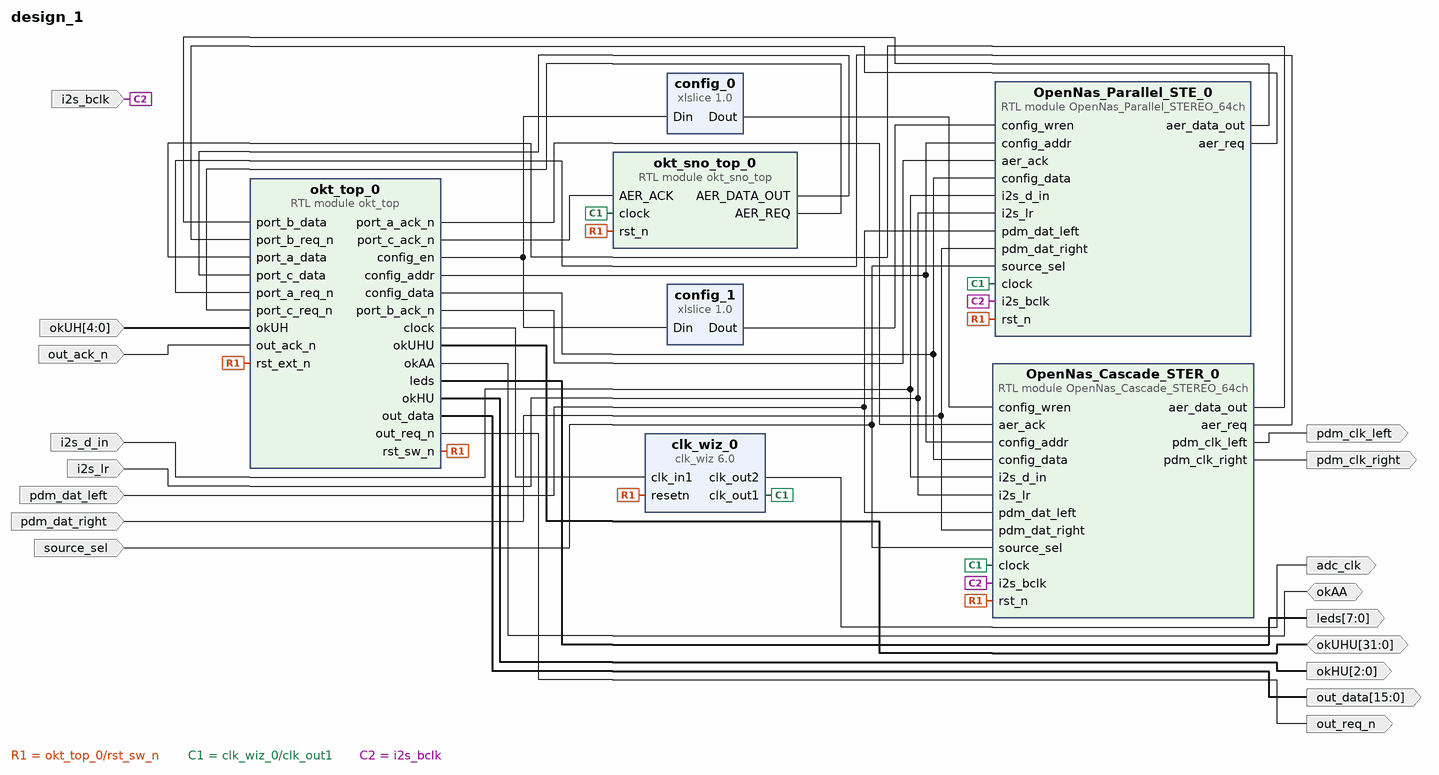
[diagram p0: block diagram of the top level]
# Vivado block design design_1, xc7a200tfbg484-1, Vivado 2022.1
create_bd_design design_1

create_bd_port -dir I pdm_dat_left
create_bd_port -dir I pdm_dat_right
create_bd_port -dir I i2s_bclk
create_bd_port -dir I i2s_d_in
create_bd_port -dir I i2s_lr
create_bd_port -dir I source_sel
create_bd_port -dir O pdm_clk_left
create_bd_port -dir O pdm_clk_right
create_bd_port -dir O -from 7 -to 0 leds
create_bd_port -dir O -from 15 -to 0 out_data
create_bd_port -dir O out_req_n
create_bd_port -dir I out_ack_n
create_bd_port -dir I -from 4 -to 0 okUH
create_bd_port -dir O -from 2 -to 0 okHU
create_bd_port -dir IO -from 31 -to 0 okUHU
create_bd_port -dir IO okAA
create_bd_port -dir O -type clk adc_clk

create_bd_cell -type ip -vlnv xilinx.com:ip:clk_wiz:6.0 clk_wiz_0
set_property -dict [list \
  CONFIG.CLKIN1_JITTER_PS 99.2 \
  CONFIG.CLKIN2_JITTER_PS 166.66 \
  CONFIG.CLKOUT1_DRIVES BUFG \
  CONFIG.CLKOUT1_JITTER 440.980 \
  CONFIG.CLKOUT1_PHASE_ERROR 472.788 \
  CONFIG.CLKOUT1_REQUESTED_DUTY_CYCLE 50.000 \
  CONFIG.CLKOUT1_REQUESTED_OUT_FREQ 48 \
  CONFIG.CLKOUT2_DRIVES BUFG \
  CONFIG.CLKOUT2_JITTER 439.220 \
  CONFIG.CLKOUT2_PHASE_ERROR 472.788 \
  CONFIG.CLKOUT2_REQUESTED_OUT_FREQ 49.152 \
  CONFIG.CLKOUT2_USED true \
  CONFIG.CLKOUT3_DRIVES BUFG \
  CONFIG.CLKOUT4_DRIVES BUFG \
  CONFIG.CLKOUT5_DRIVES BUFG \
  CONFIG.CLKOUT6_DRIVES BUFG \
  CONFIG.CLKOUT7_DRIVES BUFG \
  CONFIG.ENABLE_CLOCK_MONITOR false \
  CONFIG.FEEDBACK_SOURCE FDBK_AUTO \
  CONFIG.JITTER_SEL No_Jitter \
  CONFIG.MMCM_BANDWIDTH OPTIMIZED \
  CONFIG.MMCM_CLKFBOUT_MULT_F 51.250 \
  CONFIG.MMCM_CLKIN1_PERIOD 9.921 \
  CONFIG.MMCM_CLKIN2_PERIOD 10.000 \
  CONFIG.MMCM_CLKOUT0_DIVIDE_F 15.375 \
  CONFIG.MMCM_CLKOUT1_DIVIDE 15 \
  CONFIG.MMCM_COMPENSATION ZHOLD \
  CONFIG.MMCM_DIVCLK_DIVIDE 7 \
  CONFIG.NUM_OUT_CLKS 2 \
  CONFIG.OVERRIDE_MMCM false \
  CONFIG.PRIMITIVE MMCM \
  CONFIG.PRIM_IN_FREQ 100.800 \
  CONFIG.RESET_PORT resetn \
  CONFIG.RESET_TYPE ACTIVE_LOW \
  CONFIG.SECONDARY_IN_FREQ 100.000 \
  CONFIG.SECONDARY_SOURCE Single_ended_clock_capable_pin \
  CONFIG.USE_INCLK_SWITCHOVER false \
  CONFIG.USE_LOCKED true \
  CONFIG.USE_PHASE_ALIGNMENT true \
] [get_bd_cells clk_wiz_0]
create_bd_cell -type ip -vlnv xilinx.com:ip:xlslice:1.0 config_0
set_property -dict {CONFIG.DIN_FROM 0 CONFIG.DIN_TO 0 CONFIG.DIN_WIDTH 3 CONFIG.DOUT_WIDTH 1} [get_bd_cells config_0]
create_bd_cell -type ip -vlnv xilinx.com:ip:xlslice:1.0 config_1
set_property -dict {CONFIG.DIN_FROM 1 CONFIG.DIN_TO 1 CONFIG.DIN_WIDTH 3 CONFIG.DOUT_WIDTH 1} [get_bd_cells config_1]
create_bd_cell -type module -reference OpenNas_Cascade_STEREO_64ch OpenNas_Cascade_STER_0
create_bd_cell -type module -reference OpenNas_Parallel_STEREO_64ch OpenNas_Parallel_STE_0
create_bd_cell -type module -reference okt_sno_top okt_sno_top_0
create_bd_cell -type module -reference okt_top okt_top_0

# ---- connections ----

connect_bd_net -net Net [get_bd_pins okt_top_0/rst_sw_n] \
  [get_bd_pins clk_wiz_0/resetn] [get_bd_pins OpenNas_Cascade_STER_0/rst_n] [get_bd_pins OpenNas_Parallel_STE_0/rst_n] \
  [get_bd_pins okt_sno_top_0/rst_n] [get_bd_pins okt_top_0/rst_ext_n]
connect_bd_net [get_bd_ports okUHU] [get_bd_pins okt_top_0/okUHU]
connect_bd_net [get_bd_ports okAA] [get_bd_pins okt_top_0/okAA]
connect_bd_net -net OpenNas_Cascade_STER_0_aer_data_out [get_bd_pins OpenNas_Cascade_STER_0/aer_data_out] [get_bd_pins okt_top_0/port_a_data]
connect_bd_net -net OpenNas_Cascade_STER_0_aer_req [get_bd_pins OpenNas_Cascade_STER_0/aer_req] [get_bd_pins okt_top_0/port_a_req_n]
connect_bd_net -net OpenNas_Cascade_STER_0_pdm_clk_left [get_bd_pins OpenNas_Cascade_STER_0/pdm_clk_left] [get_bd_ports pdm_clk_left]
connect_bd_net -net OpenNas_Cascade_STER_0_pdm_clk_right [get_bd_pins OpenNas_Cascade_STER_0/pdm_clk_right] [get_bd_ports pdm_clk_right]
connect_bd_net -net OpenNas_Parallel_STE_0_aer_data_out [get_bd_pins OpenNas_Parallel_STE_0/aer_data_out] [get_bd_pins okt_top_0/port_b_data]
connect_bd_net -net OpenNas_Parallel_STE_0_aer_req [get_bd_pins OpenNas_Parallel_STE_0/aer_req] [get_bd_pins okt_top_0/port_b_req_n]
connect_bd_net [get_bd_pins clk_wiz_0/clk_out1] \
  [get_bd_pins OpenNas_Cascade_STER_0/clock] [get_bd_pins OpenNas_Parallel_STE_0/clock] [get_bd_pins okt_sno_top_0/clock]
connect_bd_net [get_bd_pins clk_wiz_0/clk_out2] [get_bd_ports adc_clk]
connect_bd_net -net config_1_Dout [get_bd_pins config_1/Dout] [get_bd_pins OpenNas_Parallel_STE_0/config_wren]
connect_bd_net -net i2s_bclk_0_1 [get_bd_ports i2s_bclk] [get_bd_pins OpenNas_Cascade_STER_0/i2s_bclk] [get_bd_pins OpenNas_Parallel_STE_0/i2s_bclk]
connect_bd_net -net i2s_d_in_0_1 [get_bd_ports i2s_d_in] [get_bd_pins OpenNas_Cascade_STER_0/i2s_d_in] [get_bd_pins OpenNas_Parallel_STE_0/i2s_d_in]
connect_bd_net -net i2s_lr_0_1 [get_bd_ports i2s_lr] [get_bd_pins OpenNas_Cascade_STER_0/i2s_lr] [get_bd_pins OpenNas_Parallel_STE_0/i2s_lr]
connect_bd_net -net okUH_0_1 [get_bd_ports okUH] [get_bd_pins okt_top_0/okUH]
connect_bd_net -net okt_sno_top_0_AER_DATA_OUT [get_bd_pins okt_sno_top_0/AER_DATA_OUT] [get_bd_pins okt_top_0/port_c_data]
connect_bd_net -net okt_sno_top_0_AER_REQ [get_bd_pins okt_sno_top_0/AER_REQ] [get_bd_pins okt_top_0/port_c_req_n]
connect_bd_net [get_bd_pins okt_top_0/clock] [get_bd_pins clk_wiz_0/clk_in1]
connect_bd_net -net okt_top_0_config_addr [get_bd_pins okt_top_0/config_addr] \
  [get_bd_pins OpenNas_Cascade_STER_0/config_addr] [get_bd_pins OpenNas_Parallel_STE_0/config_addr]
connect_bd_net -net okt_top_0_config_data [get_bd_pins okt_top_0/config_data] \
  [get_bd_pins OpenNas_Cascade_STER_0/config_data] [get_bd_pins OpenNas_Parallel_STE_0/config_data]
connect_bd_net -net okt_top_0_config_en [get_bd_pins okt_top_0/config_en] [get_bd_pins config_0/Din] [get_bd_pins config_1/Din]
connect_bd_net -net okt_top_0_leds [get_bd_pins okt_top_0/leds] [get_bd_ports leds]
connect_bd_net [get_bd_pins okt_top_0/okHU] [get_bd_ports okHU]
connect_bd_net -net okt_top_0_out_data [get_bd_pins okt_top_0/out_data] [get_bd_ports out_data]
connect_bd_net -net okt_top_0_out_req_n [get_bd_pins okt_top_0/out_req_n] [get_bd_ports out_req_n]
connect_bd_net -net okt_top_0_port_c_ack_n [get_bd_pins okt_top_0/port_c_ack_n] [get_bd_pins okt_sno_top_0/AER_ACK]
connect_bd_net -net okt_top_0_rome_a_ack_n [get_bd_pins okt_top_0/port_a_ack_n] [get_bd_pins OpenNas_Cascade_STER_0/aer_ack]
connect_bd_net -net okt_top_0_rome_b_ack_n [get_bd_pins okt_top_0/port_b_ack_n] [get_bd_pins OpenNas_Parallel_STE_0/aer_ack]
connect_bd_net -net out_ack_n_0_1 [get_bd_ports out_ack_n] [get_bd_pins okt_top_0/out_ack_n]
connect_bd_net -net pdm_dat_left_0_1 [get_bd_ports pdm_dat_left] \
  [get_bd_pins OpenNas_Cascade_STER_0/pdm_dat_left] [get_bd_pins OpenNas_Parallel_STE_0/pdm_dat_left]
connect_bd_net -net pdm_dat_right_0_1 [get_bd_ports pdm_dat_right] \
  [get_bd_pins OpenNas_Cascade_STER_0/pdm_dat_right] [get_bd_pins OpenNas_Parallel_STE_0/pdm_dat_right]
connect_bd_net -net source_sel_0_1 [get_bd_ports source_sel] \
  [get_bd_pins OpenNas_Cascade_STER_0/source_sel] [get_bd_pins OpenNas_Parallel_STE_0/source_sel]
connect_bd_net -net xlslice_0_Dout [get_bd_pins config_0/Dout] [get_bd_pins OpenNas_Cascade_STER_0/config_wren]
set_property HDL_ATTRIBUTE.DEBUG true [get_bd_nets Net]
set_property HDL_ATTRIBUTE.MARK_DEBUG true [get_bd_nets Net]
set_property HDL_ATTRIBUTE.DEBUG true [get_bd_nets OpenNas_Cascade_STER_0_aer_data_out]
set_property HDL_ATTRIBUTE.MARK_DEBUG true [get_bd_nets OpenNas_Cascade_STER_0_aer_data_out]
set_property HDL_ATTRIBUTE.DEBUG true [get_bd_nets OpenNas_Cascade_STER_0_aer_req]
set_property HDL_ATTRIBUTE.MARK_DEBUG true [get_bd_nets OpenNas_Cascade_STER_0_aer_req]
set_property HDL_ATTRIBUTE.DEBUG true [get_bd_nets OpenNas_Cascade_STER_0_pdm_clk_left]
set_property HDL_ATTRIBUTE.MARK_DEBUG true [get_bd_nets OpenNas_Cascade_STER_0_pdm_clk_left]
set_property HDL_ATTRIBUTE.DEBUG true [get_bd_nets OpenNas_Cascade_STER_0_pdm_clk_right]
set_property HDL_ATTRIBUTE.MARK_DEBUG true [get_bd_nets OpenNas_Cascade_STER_0_pdm_clk_right]
set_property HDL_ATTRIBUTE.DEBUG true [get_bd_nets OpenNas_Parallel_STE_0_aer_data_out]
set_property HDL_ATTRIBUTE.MARK_DEBUG true [get_bd_nets OpenNas_Parallel_STE_0_aer_data_out]
set_property HDL_ATTRIBUTE.DEBUG true [get_bd_nets OpenNas_Parallel_STE_0_aer_req]
set_property HDL_ATTRIBUTE.MARK_DEBUG true [get_bd_nets OpenNas_Parallel_STE_0_aer_req]
set_property HDL_ATTRIBUTE.DEBUG true [get_bd_nets config_1_Dout]
set_property HDL_ATTRIBUTE.MARK_DEBUG true [get_bd_nets config_1_Dout]
set_property HDL_ATTRIBUTE.DEBUG true [get_bd_nets i2s_bclk_0_1]
set_property HDL_ATTRIBUTE.MARK_DEBUG true [get_bd_nets i2s_bclk_0_1]
set_property HDL_ATTRIBUTE.DEBUG true [get_bd_nets i2s_d_in_0_1]
set_property HDL_ATTRIBUTE.MARK_DEBUG true [get_bd_nets i2s_d_in_0_1]
set_property HDL_ATTRIBUTE.DEBUG true [get_bd_nets i2s_lr_0_1]
set_property HDL_ATTRIBUTE.MARK_DEBUG true [get_bd_nets i2s_lr_0_1]
set_property HDL_ATTRIBUTE.DEBUG true [get_bd_nets okt_sno_top_0_AER_DATA_OUT]
set_property HDL_ATTRIBUTE.MARK_DEBUG true [get_bd_nets okt_sno_top_0_AER_DATA_OUT]
set_property HDL_ATTRIBUTE.DEBUG true [get_bd_nets okt_sno_top_0_AER_REQ]
set_property HDL_ATTRIBUTE.MARK_DEBUG true [get_bd_nets okt_sno_top_0_AER_REQ]
set_property HDL_ATTRIBUTE.DEBUG true [get_bd_nets okt_top_0_config_addr]
set_property HDL_ATTRIBUTE.MARK_DEBUG true [get_bd_nets okt_top_0_config_addr]
set_property HDL_ATTRIBUTE.DEBUG true [get_bd_nets okt_top_0_config_data]
set_property HDL_ATTRIBUTE.MARK_DEBUG true [get_bd_nets okt_top_0_config_data]
set_property HDL_ATTRIBUTE.DEBUG true [get_bd_nets okt_top_0_config_en]
set_property HDL_ATTRIBUTE.MARK_DEBUG true [get_bd_nets okt_top_0_config_en]
set_property HDL_ATTRIBUTE.DEBUG true [get_bd_nets okt_top_0_leds]
set_property HDL_ATTRIBUTE.MARK_DEBUG true [get_bd_nets okt_top_0_leds]
set_property HDL_ATTRIBUTE.DEBUG true [get_bd_nets okt_top_0_out_data]
set_property HDL_ATTRIBUTE.MARK_DEBUG true [get_bd_nets okt_top_0_out_data]
set_property HDL_ATTRIBUTE.DEBUG true [get_bd_nets okt_top_0_out_req_n]
set_property HDL_ATTRIBUTE.MARK_DEBUG true [get_bd_nets okt_top_0_out_req_n]
set_property HDL_ATTRIBUTE.DEBUG true [get_bd_nets okt_top_0_port_c_ack_n]
set_property HDL_ATTRIBUTE.MARK_DEBUG true [get_bd_nets okt_top_0_port_c_ack_n]
set_property HDL_ATTRIBUTE.DEBUG true [get_bd_nets okt_top_0_rome_a_ack_n]
set_property HDL_ATTRIBUTE.MARK_DEBUG true [get_bd_nets okt_top_0_rome_a_ack_n]
set_property HDL_ATTRIBUTE.DEBUG true [get_bd_nets okt_top_0_rome_b_ack_n]
set_property HDL_ATTRIBUTE.MARK_DEBUG true [get_bd_nets okt_top_0_rome_b_ack_n]
set_property HDL_ATTRIBUTE.DEBUG true [get_bd_nets out_ack_n_0_1]
set_property HDL_ATTRIBUTE.MARK_DEBUG true [get_bd_nets out_ack_n_0_1]
set_property HDL_ATTRIBUTE.DEBUG true [get_bd_nets pdm_dat_left_0_1]
set_property HDL_ATTRIBUTE.MARK_DEBUG true [get_bd_nets pdm_dat_left_0_1]
set_property HDL_ATTRIBUTE.DEBUG true [get_bd_nets pdm_dat_right_0_1]
set_property HDL_ATTRIBUTE.MARK_DEBUG true [get_bd_nets pdm_dat_right_0_1]
set_property HDL_ATTRIBUTE.DEBUG true [get_bd_nets source_sel_0_1]
set_property HDL_ATTRIBUTE.MARK_DEBUG true [get_bd_nets source_sel_0_1]
set_property HDL_ATTRIBUTE.DEBUG true [get_bd_nets xlslice_0_Dout]
set_property HDL_ATTRIBUTE.MARK_DEBUG true [get_bd_nets xlslice_0_Dout]

validate_bd_design
save_bd_design
